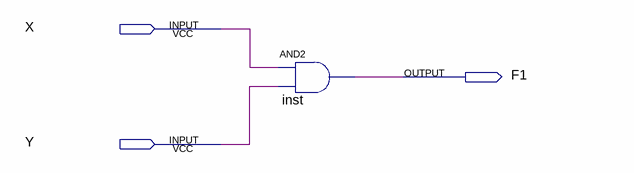
[diagram p0: schematic sheet]
// Quartus schematic GateDemo.bdf as structural Verilog: 1 symbols, 3 pins
module GateDemo (
  input  X,
  input  Y,
  output F1
);

  and inst (F1, X, Y);
endmodule
